# Altium schematic sheet Power.SchDoc
size A4; SheetNumber: 2; SheetTotal: 2
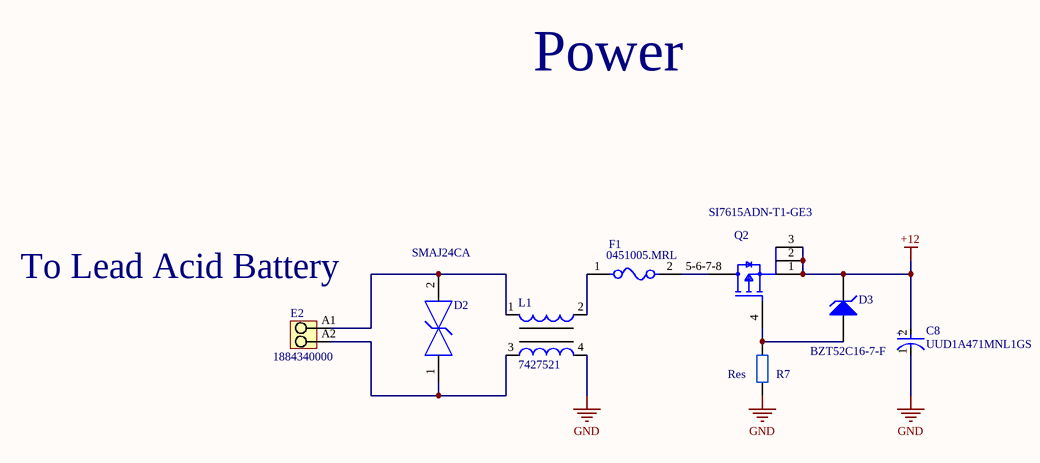
[diagram p0: Power.SchDoc]

## Parts
C8  UUD1A471MNL1GS  [FP-UUD1A471MNL1GS-MFG]
D2  SMAJ24CA  [FP-SMAJ-CA-MFG]
D3  BZT52C16-7-F  [DIOD-SOD123-2_V]
E2  1884340000  [LSF_SMT_5_00_135_02]
F1  0451005.MRL  [FP-0451-MFG]
L1  7427521  [WE-CMS]
Q2  SI7615ADN-T1-GE3  [FP-S16-2667_SINGLE-MFG]
R7  Res  [R0603 (1608)]

## Nets
+12: C8.2(A) D3.2(K) Q2.1(S) Q2.2(S) Q2.3(S)
GND: C8.1(C) L1.4 R7.1
NetD2_1: D2.1 E2.A2 L1.3
NetD2_2: D2.2 E2.A1 L1.1
NetD3_1: D3.1(A) Q2.4(G) R7.2
NetF1_1: F1.1 L1.2
NetF1_2: F1.2 Q2.5-6-7-8(D)

## Notes on the sheet
- Power
- To Lead Acid Battery
- (in symbol CMP-0687-00070-2) +

## Library data of the parts
C8 = CMP-0687-00070-2: CAP ALUM 470UF 20% 10V SMD; Leakage Current: 3uA; Lead Diameter: 1.1mm; Ripple Current: 450mA; Dissipation Factor: 0.24%; Life (Hours): 5000Hour; Dielectric Material: Aluminium; Impedance: 170mR; Voltage Rating: 10V; Height - Seated (Max): 0.394inch; Packaging: Tape and Reel; Voltage Rating (DC): 10V; Package Quantity: 500; Radiation Hardening: No; Capacitance: 470uF; Min Operating Temperature: -55°C; Max Operating Temperature: 105°C; REACH SVHC: No SVHC; Tolerance: 20%; Termination: SMD/SMT; Lead Free: Lead Free; Diameter: 8mm; Case/Package: Radial; Length: 10mm; Voltage: 10V; Ripple Current (AC): 450mA; Height: 10mm; Lead Pitch: 3.1mm; Number of Pins: 2
D2 = CMP-2000-07087-2: TVS DIODE 24V 38.9V DO214AC; Manufacturer: Littelfuse; Peak Pulse Power: 400W; Direction: Bidirectional; Breakdown Voltage: 26.7V; Max Junction Temp: +150°C; Number Of Channels: 1; Peak Pulse Current: 10.3A; Digikey Description: TVS DIODE 24V 38.9V DO214AC; Temperature Range Low: -65°C; Temperature: -65°C to +150°C; Manufacturer Part Number: SMAJ24CA; Octopart: https://octopart.com/smaj24ca-littelfuse-350011; Height: 2.29mm; Clamping Voltage: 38.9V; Device Class L1: Circuit Protection; Automotive: No; Device Class L2: TVS Diodes; Package: SMAJ-CA; ComponentLink2URL: https://www.littelfuse.com/~/media/electronics/datasheets/tvs_diodes/littelfuse_tvs_diode_smaj_datasheet.pdf.pdf; RoHS: TRUE; Temperature Range High: +150°C; Category: Diode; Lead Free: Yes; Reverse Standoff Voltage: 24V; Device Class L3: unset; ComponentLink2Description: Datasheet; Mouser Description: In a Pack of 25, Littelfuse SMAJ24CA, Bi-Directional TVS Diode, 400W, 2-Pin DO-214AC
D3 = CMP-0860-00001-1: Surface Mount Zener Diode, 16 V, -65 to 125 degC, SOD123, RoHS, Tape and Reel; Manufacturer: Diodes Inc; Maximum Reverse Current: 0.1 uA; Tol V: 5.56% Typ.; Maximum Zener Impedance f: 1 kHz ZZK=200 Ohm; Voltage Zener: 16 V Typ.; Power Max: 500 mW; ComponentLink2URL: http://www.diodes.com/datasheets/ds18004.pdf; PackageDescription: 2-Pin SOD123, Body 2.7 x 1.55 mm, Height 1.45 mm; ComponentLink3Description: Package Specification; Mounting Technology: Surface Mount; PackageReference: SOD123; ComponentLink2Description: Datasheet; RoHS: TRUE; ComponentLink3URL: http://www.diodes.com/datasheets/ap02002.pdf; Operating Temperature: -65 to 150 degC; DatasheetVersion: Rev. 37-2; Packing: Tape and Reel; ComponentLink1Description: Manufacturer URL; ComponentLink1URL: http://www.diodes.com/; PackageVersion: Rev. 79; PartNumber: BZT52C16-7-F
E2 = CMP-1559-02276-1: OMNIMATE Signal - series LSF; Manufacturer: Weidmueller; Rated_voltage_for_surge_voltage_class_pollution_degree_II_2: 500 V; Pitch_mm: 5 mm; Wire_cross_section_AWG_min_UL_1059: AWG 24; Insulating_material: LCP GF; Rated_voltage_use_group_B_UL_1059: 300 V; Rated_current_use_group_B_UL_1059: 12 A; Mounting_onto_the_PCB: Reflow solder connection; Contact_material: Cu-Leg; Short_text_for_material: LSF-SMT 5.00/02/135 3.5SN BK TU; No_of_poles: 2; UL_94_flammability_rating: V-0; Solid_min_H05_07_V_U: 0,2 mm²; Contact_surface: tinned; Side_termination_characteristic: closed side; Wire_cross_section_AWG_max_UL_1059: AWG 16; Solder_pin_length_mm: 3,5 mm; Pitch_inch: 0,197 inch; Solid_max_H05_07_V_U: 1,5 mm²; Rated_current_min_no_of_poles_TU_20_deg_C: 19 A; Packaging: Tube; ComponentLink1URL: http://www.weidmueller.com/; ComponentLink2URL: http://catalog.weidmueller.com/catalog/Start.do?localeId=en&ObjectID=1884340000; PackageReference: LSF_SMT_5_00_135_02; PartNumber: 1884340000; ComponentLink1Description: Manufacturer URL; Qty: 60 PCS; Colour: Black; Revision: V1; ComponentLink2Description: URL Link1
F1 = CMP-2000-05653-2: FUSE BRD MNT 5A 125VAC/VDC 2SMD; Manufacturer: Littelfuse Inc; Fuse Blow Speed: Fast; Voltage Rating: 125V; Fuse Interrupt Ac Current: 50A; Value: 0.0125Ω; Fuse I2T: 5.566A2Sec; Device Class L3: unset; Temperature Range Low: -55°C; Height: 2.94mm; Category: Fuse; Fuse Current: 5A; Octopart: https://octopart.com/0451005.mrl-littelfuse-566389; Package: 0451; RoHS: TRUE; Manufacturer Part Number: 0451005.MRL; Mouser Description: Surface Mount Fuses 125V 5A; Device Class L2: Fuses; ComponentLink2URL: https://www.littelfuse.com/~/media/electronics/datasheets/fuses/littelfuse_fuse_451_453_datasheet.pdf.pdf; Temperature Range High: +125°C; Digikey Description: FUSE BRD MNT 5A 125VAC/VDC 2SMD; Device Class L1: Circuit Protection; Automotive: No; Fuse Interrupt Dc Current: 50A; Temperature: -55°C to +125°C; Max Fuse Dc Voltage: 125V; Resistance: 0.0125Ω; ComponentLink2Description: Datasheet; Max Fuse Ac Voltage: 125V; Lead Free: Yes
L1 = CMP-0220-00057-1: Common Mode SMD Bead WE-CMS, Z = 52 Ohm; Impedance: 52 Ohm; PackageReference: WE-CMS; PackageVersion: 2010; ComponentLink1URL: http://www.we-online.com; PackageDescription: Inductor, 4-Leads, Body 8.5 x 5.6 mm; ComponentLink2Description: Datasheet; ComponentLink2URL: http://www.we-online.de/katalog/media/pdf/7427521.pdf; DatasheetVersion: ver 8, Jul-2010; ComponentLink1Description: Manufacturer Link
Q2 = CMP-02550-000167-1: MOSFET P-CH 20V 35A 1212-8S; Manufacturer: Vishay; Gate Charge At Vgs: 122nC @ -10V; Max Forward Diode Voltage: -1.1V; Continuous Drain Current: -22.1A; Gate To Source Voltage: 12V; Number Of P Channels: 1; Pulse Drain Current: -80A; Threshold Vgs Max: -1.5V; Drain To Source Voltage: -20V; Reverse Recovery Time: 27ns; Depletion Mode: False; Reverse Recovery Charge: 11nC; Power Dissipation: 3.7W; Rthja Max: 33°C/W; Typ Forward Diode Voltage: -0.72V; Standoff Height: 0mm; Input Capacitace At Vds: 5590pF @ -10V; Turn On Delay Time: 13ns; Turn Off Delay Time: 85ns; Max Junction Temp: +150°C; Transconductance: 82S; Threshold Vgs Min: -0.4V; Drain To Source Resistance: 0.0035Ω; Manufacturer Part Number: SI7615ADN-T1-GE3; Package: S16-2667_SINGLE; Height: 1.12mm; Automotive: No; Device Class L3: MOSFETs; Device Class L1: Discrete Semiconductors; Digikey Description: MOSFET P-CH 20V 35A 1212-8S; Category: Trans; Device Class L2: Transistors; Drain To Source Breakdown Voltage: -20V; Temperature Range High: +150°C; Octopart: https://octopart.com/si7615adn-t1-ge3-vishay-45331111; Number Of Channels: 1; RoHS: TRUE; Temperature: -55°C to +150°C; ComponentLink2URL: http://www.vishay.com/docs/62667/si7615adn.pdf; Temperature Range Low: -55°C; Lead Free: Yes; ComponentLink2Description: Datasheet; Mouser Description: MOSFET -20V 4.4mOhm@10V 35A P-Ch G-III
R7 = Resistor EU